# Altium schematic sheet B2_RAD_FPGA_t.SchDoc: ASIM MXGS PSU Controller QM
size A4; Author: Andrzej Cichocki; Organization: Space Research Centre; Address1: Bartycka 18a; Address2: 00-716 Warsaw; Address3: Poland; Revision: 1; ModuleName: MainBoard Main; SubOrganization1: FPGA Satellite Applications Lab.
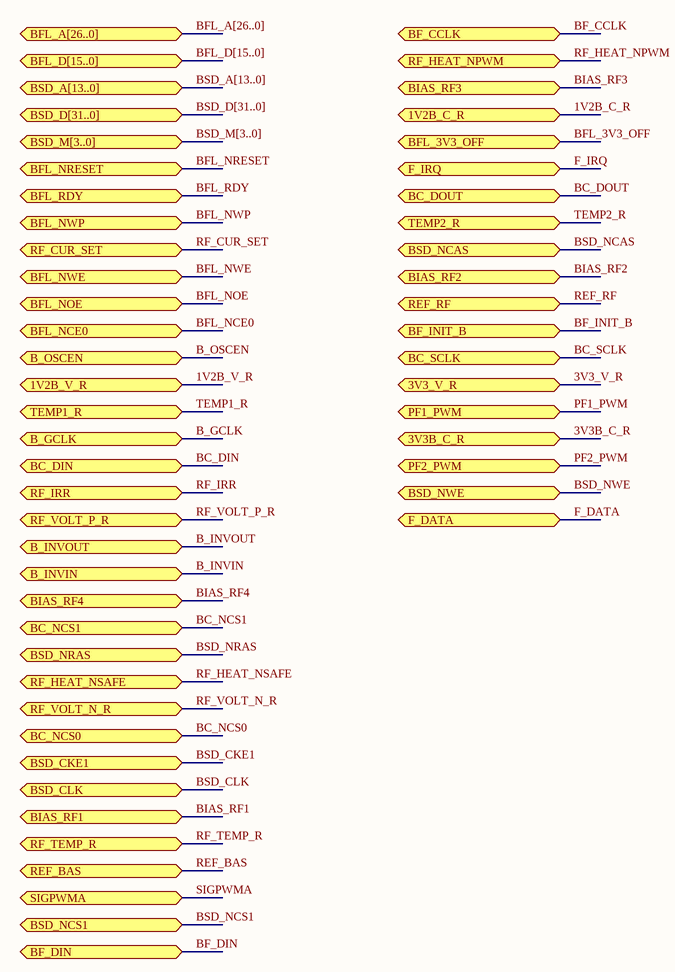
[diagram p0: B2_RAD_FPGA_t.SchDoc]

## Ports
1V2B_C_R (bidir), 1V2B_V_R (bidir), 3V3_V_R (bidir), 3V3B_C_R (bidir), B_GCLK (bidir), B_INVIN (bidir), B_INVOUT (bidir), B_OSCEN (bidir), BC_DIN (bidir), BC_DOUT (bidir), BC_NCS0 (bidir), BC_NCS1 (bidir), BC_SCLK (bidir), BF_CCLK (bidir), BF_DIN (bidir), BF_INIT_B (bidir), BFL_3V3_OFF (bidir), BFL_A[26..0] (bidir), BFL_D[15..0] (bidir), BFL_NCE0 (bidir), BFL_NOE (bidir), BFL_NRESET (bidir), BFL_NWE (bidir), BFL_NWP (bidir), BFL_RDY (bidir), BIAS_RF1 (bidir), BIAS_RF2 (bidir), BIAS_RF3 (bidir), BIAS_RF4 (bidir), BSD_A[13..0] (bidir), BSD_CKE1 (bidir), BSD_CLK (bidir), BSD_D[31..0] (bidir), BSD_M[3..0] (bidir), BSD_NCAS (bidir), BSD_NCS1 (bidir), BSD_NRAS (bidir), BSD_NWE (bidir), F_DATA (bidir), F_IRQ (bidir), PF1_PWM (bidir), PF2_PWM (bidir), REF_BAS (bidir), REF_RF (bidir), RF_CUR_SET (bidir), RF_HEAT_NPWM (bidir), RF_HEAT_NSAFE (bidir), RF_IRR (bidir), RF_TEMP_R (bidir), RF_VOLT_N_R (bidir), RF_VOLT_P_R (bidir), SIGPWMA (bidir), TEMP1_R (bidir), TEMP2_R (bidir)

## Nets
1V2B_C_R: port 1V2B_C_R
1V2B_V_R: port 1V2B_V_R
3V3_V_R: port 3V3_V_R
3V3B_C_R: port 3V3B_C_R
B_GCLK: port B_GCLK
B_INVIN: port B_INVIN
B_INVOUT: port B_INVOUT
B_OSCEN: port B_OSCEN
BC_DIN: port BC_DIN
BC_DOUT: port BC_DOUT
BC_NCS0: port BC_NCS0
BC_NCS1: port BC_NCS1
BC_SCLK: port BC_SCLK
BF_CCLK: port BF_CCLK
BF_DIN: port BF_DIN
BF_INIT_B: port BF_INIT_B
BFL_3V3_OFF: port BFL_3V3_OFF
BFL_NCE0: port BFL_NCE0
BFL_NOE: port BFL_NOE
BFL_NRESET: port BFL_NRESET
BFL_NWE: port BFL_NWE
BFL_NWP: port BFL_NWP
BFL_RDY: port BFL_RDY
BIAS_RF1: port BIAS_RF1
BIAS_RF2: port BIAS_RF2
BIAS_RF3: port BIAS_RF3
BIAS_RF4: port BIAS_RF4
BSD_CKE1: port BSD_CKE1
BSD_CLK: port BSD_CLK
BSD_NCAS: port BSD_NCAS
BSD_NCS1: port BSD_NCS1
BSD_NRAS: port BSD_NRAS
BSD_NWE: port BSD_NWE
F_DATA: port F_DATA
F_IRQ: port F_IRQ
PF1_PWM: port PF1_PWM
PF2_PWM: port PF2_PWM
REF_BAS: port REF_BAS
REF_RF: port REF_RF
RF_CUR_SET: port RF_CUR_SET
RF_HEAT_NPWM: port RF_HEAT_NPWM
RF_HEAT_NSAFE: port RF_HEAT_NSAFE
RF_IRR: port RF_IRR
RF_TEMP_R: port RF_TEMP_R
RF_VOLT_N_R: port RF_VOLT_N_R
RF_VOLT_P_R: port RF_VOLT_P_R
SIGPWMA: port SIGPWMA
TEMP1_R: port TEMP1_R
TEMP2_R: port TEMP2_R

## Buses and harness runs
bus BFL_A[26..0] = port BFL_A[26..0]
bus BFL_D[15..0] = port BFL_D[15..0]
bus BSD_A[13..0] = port BSD_A[13..0]
bus BSD_D[31..0] = port BSD_D[31..0]
bus BSD_M[3..0] = port BSD_M[3..0]

## Notes on the sheet
- Module:
- Project:
- Modified:
- Rev.:
- Author: